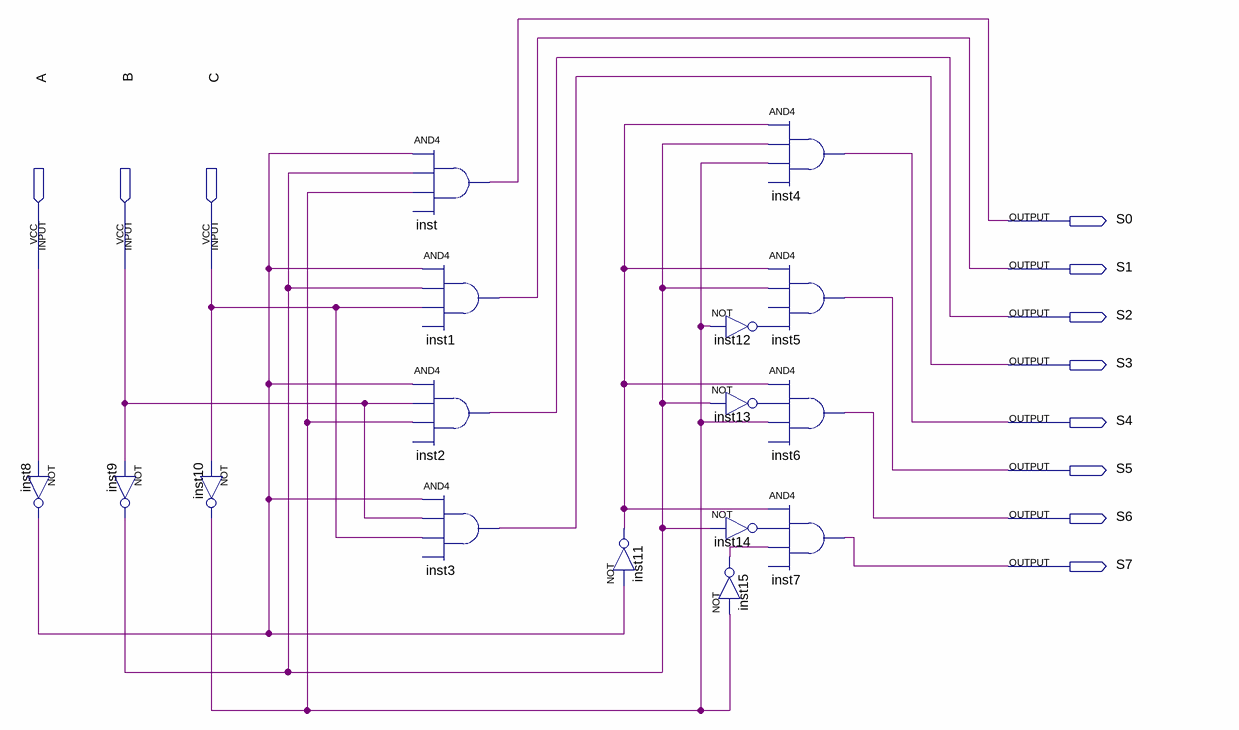
[diagram p0: schematic sheet]
// Quartus schematic demux.bdf as structural Verilog: 16 symbols, 11 pins
module demux (
  input  A,
  input  B,
  input  C,
  output S0,
  output S1,
  output S2,
  output S3,
  output S4,
  output S5,
  output S6,
  output S7
);

  wire inst8_out, inst9_out, inst10_out, inst11_out, inst12_out, inst13_out, inst14_out, inst15_out;

  not inst8 (inst8_out, A);
  not inst9 (inst9_out, B);
  not inst10 (inst10_out, C);
  and inst (S0, inst8_out, inst9_out, inst10_out);  // open: IN4
  and inst1 (S1, inst8_out, inst9_out, C);  // open: IN4
  and inst2 (S2, inst8_out, B, inst10_out);  // open: IN4
  and inst3 (S3, inst8_out, B, C);  // open: IN4
  not inst11 (inst11_out, inst8_out);
  not inst12 (inst12_out, inst10_out);
  not inst13 (inst13_out, inst9_out);
  not inst14 (inst14_out, inst9_out);
  not inst15 (inst15_out, inst10_out);
  and inst4 (S4, inst11_out, inst9_out, inst10_out);  // open: IN4
  and inst5 (S5, inst11_out, inst9_out, inst12_out);  // open: IN3
  and inst6 (S6, inst11_out, inst13_out, inst10_out);  // open: IN4
  and inst7 (S7, inst11_out, inst14_out, inst15_out);  // open: IN4
endmodule
